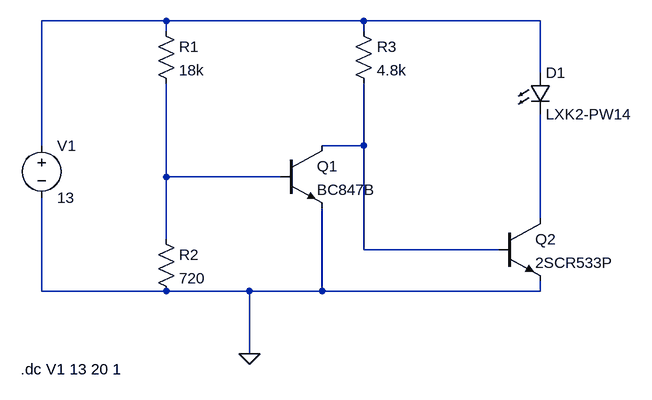
[diagram p0: schematic Draft1.asc]
Draft1.asc, the LTspice schematic file:
Version 4
SHEET 1 880 680
WIRE 112 -48 -80 -48
WIRE 416 -48 112 -48
WIRE 688 -48 416 -48
WIRE 112 -32 112 -48
WIRE 416 -32 416 -48
WIRE 688 32 688 -48
WIRE -80 144 -80 -48
WIRE 416 144 416 48
WIRE 416 144 352 144
WIRE 112 192 112 48
WIRE 288 192 112 192
WIRE 688 256 688 96
WIRE 112 288 112 192
WIRE 416 304 416 144
WIRE 624 304 416 304
WIRE -80 368 -80 224
WIRE 112 368 -80 368
WIRE 240 368 112 368
WIRE 352 368 352 240
WIRE 352 368 240 368
WIRE 688 368 688 352
WIRE 688 368 352 368
WIRE 240 464 240 368
FLAG 240 464 0
SYMBOL res 96 -48 R0
SYMATTR InstName R1
SYMATTR Value 18k
SYMBOL res 96 272 R0
SYMATTR InstName R2
SYMATTR Value 720
SYMBOL res 400 -48 R0
SYMATTR InstName R3
SYMATTR Value 4.8k
SYMBOL voltage -80 128 R0
WINDOW 123 0 0 Left 0
WINDOW 39 0 0 Left 0
SYMATTR InstName V1
SYMATTR Value 13
SYMBOL npn 288 144 R0
SYMATTR InstName Q1
SYMATTR Value BC847B
SYMBOL npn 624 256 R0
SYMATTR InstName Q2
SYMATTR Value 2SCR533P
SYMBOL LED 672 32 R0
SYMATTR InstName D1
SYMATTR Value LXK2-PW14
TEXT -112 488 Left 2 !.dc V1 13 20 1

The netlist it stands for:
* Draft1.asc
R1 N001 N003 18k
R2 N003 0 720
R3 N001 N002 4.8k
V1 N001 0 13
Q1 N002 N003 0 0 BC847B
Q2 N004 N002 0 0 2SCR533P
D1 N001 N004 LXK2-PW14
.model D D
.lib standard.dio
.model NPN NPN
.model PNP PNP
.lib standard.bjt
.dc V1 13 20 1
.backanno
.end